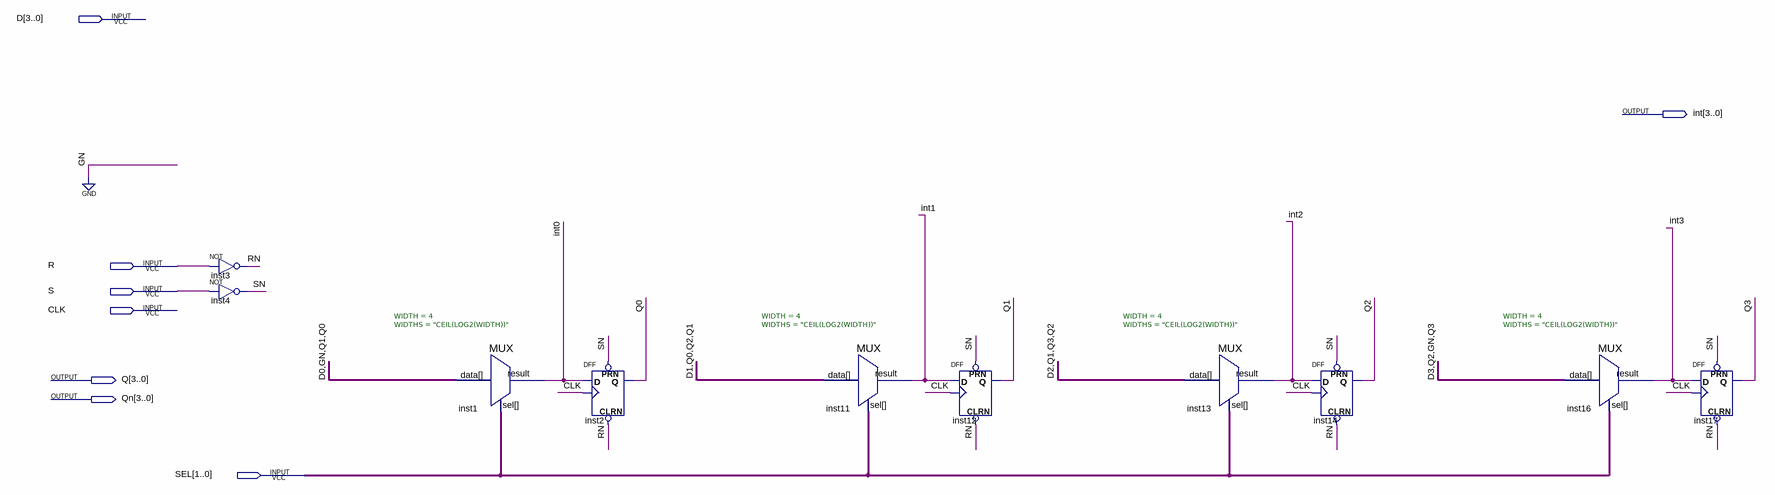
[diagram p0: schematic sheet]
// Quartus schematic shiftreg4bitsbib.bdf as structural Verilog: 10 symbols, 8 pins
module shiftreg4bitsbib (
  input  [3:0] D,
  input  R,
  input  S,
  input  CLK,
  input  [1:0] SEL,
  output [3:0] \int ,
  output [3:0] Q,
  output [3:0] Qn
);

  wire RN, SN;

  not inst3 (RN, R);
  not inst4 (SN, S);
  MUX #(.WIDTH(4), .WIDTHS("CEIL(LOG2(WIDTH))")) inst1 (.data({D[0], 1'b0, Q[1:0]}), .sel(SEL), .result(\int [0]));
  DFF inst2 (.CLRN(RN), .CLK(CLK), .D(\int [0]), .PRN(SN), .Q(Q[0]));
  MUX #(.WIDTH(4), .WIDTHS("CEIL(LOG2(WIDTH))")) inst11 (.data({D[1], Q[0], Q[2:1]}), .sel(SEL), .result(\int [1]));
  DFF inst12 (.CLRN(RN), .CLK(CLK), .D(\int [1]), .PRN(SN), .Q(Q[1]));
  MUX #(.WIDTH(4), .WIDTHS("CEIL(LOG2(WIDTH))")) inst13 (.data({D[2], Q[1], Q[3:2]}), .sel(SEL), .result(\int [2]));
  DFF inst14 (.CLRN(RN), .CLK(CLK), .D(\int [2]), .PRN(SN), .Q(Q[2]));
  MUX #(.WIDTH(4), .WIDTHS("CEIL(LOG2(WIDTH))")) inst16 (.data({D[3], Q[2], 1'b0, Q[3]}), .sel(SEL), .result(\int [3]));
  DFF inst17 (.CLRN(RN), .CLK(CLK), .D(\int [3]), .PRN(SN), .Q(Q[3]));
endmodule
